# EAGLE design ICSP-half-size-adapter (EAGLE 9.6.1)
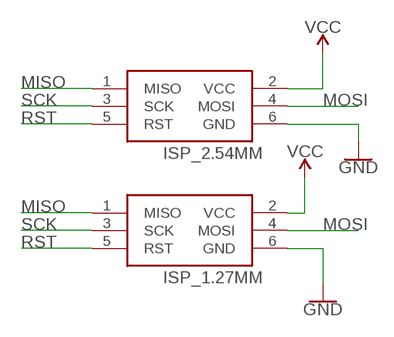
[diagram p0: schematic, sheet 1]

## Parts
ISP_1.27MM  AVRISP1.27MM  [2X3_1.27]
ISP_2.54MM  AVRISP-6  [AVRISP]

## Nets
GND: ISP_1.27MM.6(GND) ISP_2.54MM.6(GND)
MISO: ISP_1.27MM.1(MISO) ISP_2.54MM.1(MISO)
MOSI: ISP_1.27MM.4(MOSI) ISP_2.54MM.4(MOSI)
RST: ISP_1.27MM.5(RST) ISP_2.54MM.5(RST)
SCK: ISP_1.27MM.3(SCK) ISP_2.54MM.3(SCK)
VCC: ISP_1.27MM.2(VCC) ISP_2.54MM.2(VCC)

## Library data of the parts
ISP_1.27MM ISP_2.54MM = bschulz:AVRISP: AVR ISP HEADER Standard 6 pin header for AVR programming

## Board
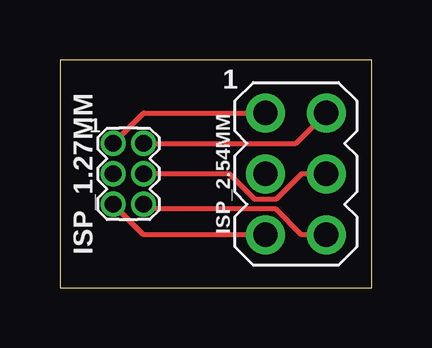
[diagram p1: board, top side]
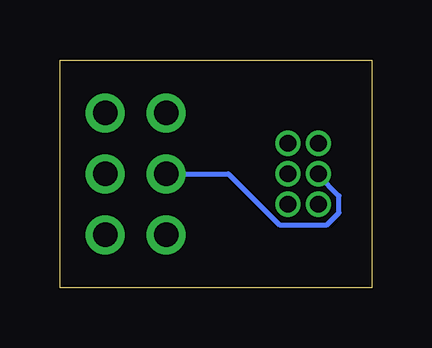
[diagram p2: board, bottom side, seen from below]

Size 13.01 x 9.52 mm. Coordinates in mm from the lower left corner, seen from the top.
Outline: 0,0 13.01,0 13.01,9.52 0,9.52 0,0
Copper layers (1*16): Top 0.035559375mm / dielectric 1.6mm / Bottom 0.035559375mm
Design rules "oshpark-2layer": minimum track width 6mil, minimum drill 10mil, track to track 6mil, track to pad 6mil, pad to pad 6mil, via to via 6mil, smd to smd 6mil, copper to edge 15mil, drill to drill 6mil, minimum pad ring 5mil, minimum via ring 5mil, stop-mask expansion 2.5mil, vias tented up to drill 0mil, thermal gap 10mil

### Footprints (pad centres in the part's own frame; a part is rotated, then mirrored left to right if it is on the bottom)
2X3_1.27 = drill 0.7 pad 1.05: 1 -1.27,-0.635; 2 -1.27,0.635; 3 0,-0.635; 4 0,0.635; 5 1.27,-0.635; 6 1.27,0.635
AVRISP = drill 1.02 pad 1.626: 1 -1.27,2.54; 2 1.27,2.54; 3 -1.27,0; 4 1.27,0; 5 -1.27,-2.54; 6 1.27,-2.54

### Placement (x,y rotation side)
ISP_1.27MM  2.86,4.76 270 top
ISP_2.54MM  9.84,4.76 0 top

### Tracks (layer width: path | path; a pad name or v marks a point on that pad's centre or on a via)
GND
  Top 0.203: ISP_2.54MM.6 10.08,2.22 9.01,3.29 3.7,3.29 ISP_1.27MM.6
MISO
  Top 0.203: ISP_1.27MM.1 3.49,7.3 ISP_2.54MM.1
MOSI
  Top 0.203: ISP_2.54MM.4 10.08,4.76 9.01,3.7 8.13,3.7 7.06,4.76 ISP_1.27MM.4
RST
  Top 0.203: ISP_2.54MM.5 3.49,2.22 ISP_1.27MM.5
SCK
  Bottom 0.203: ISP_2.54MM.3 5.98,4.76 3.85,2.63 1.87,2.63 1.36,3.14 1.36,3.85 2.22,4.71 ISP_1.27MM.3
VCC
  Top 0.203: ISP_1.27MM.2 9.84,6.03 ISP_2.54MM.2

### Text on the board
tDocu: 2.54 mm / this side
bDocu: 1.27 mm / this side